# Altium project STM32_Smart.PrjPcb
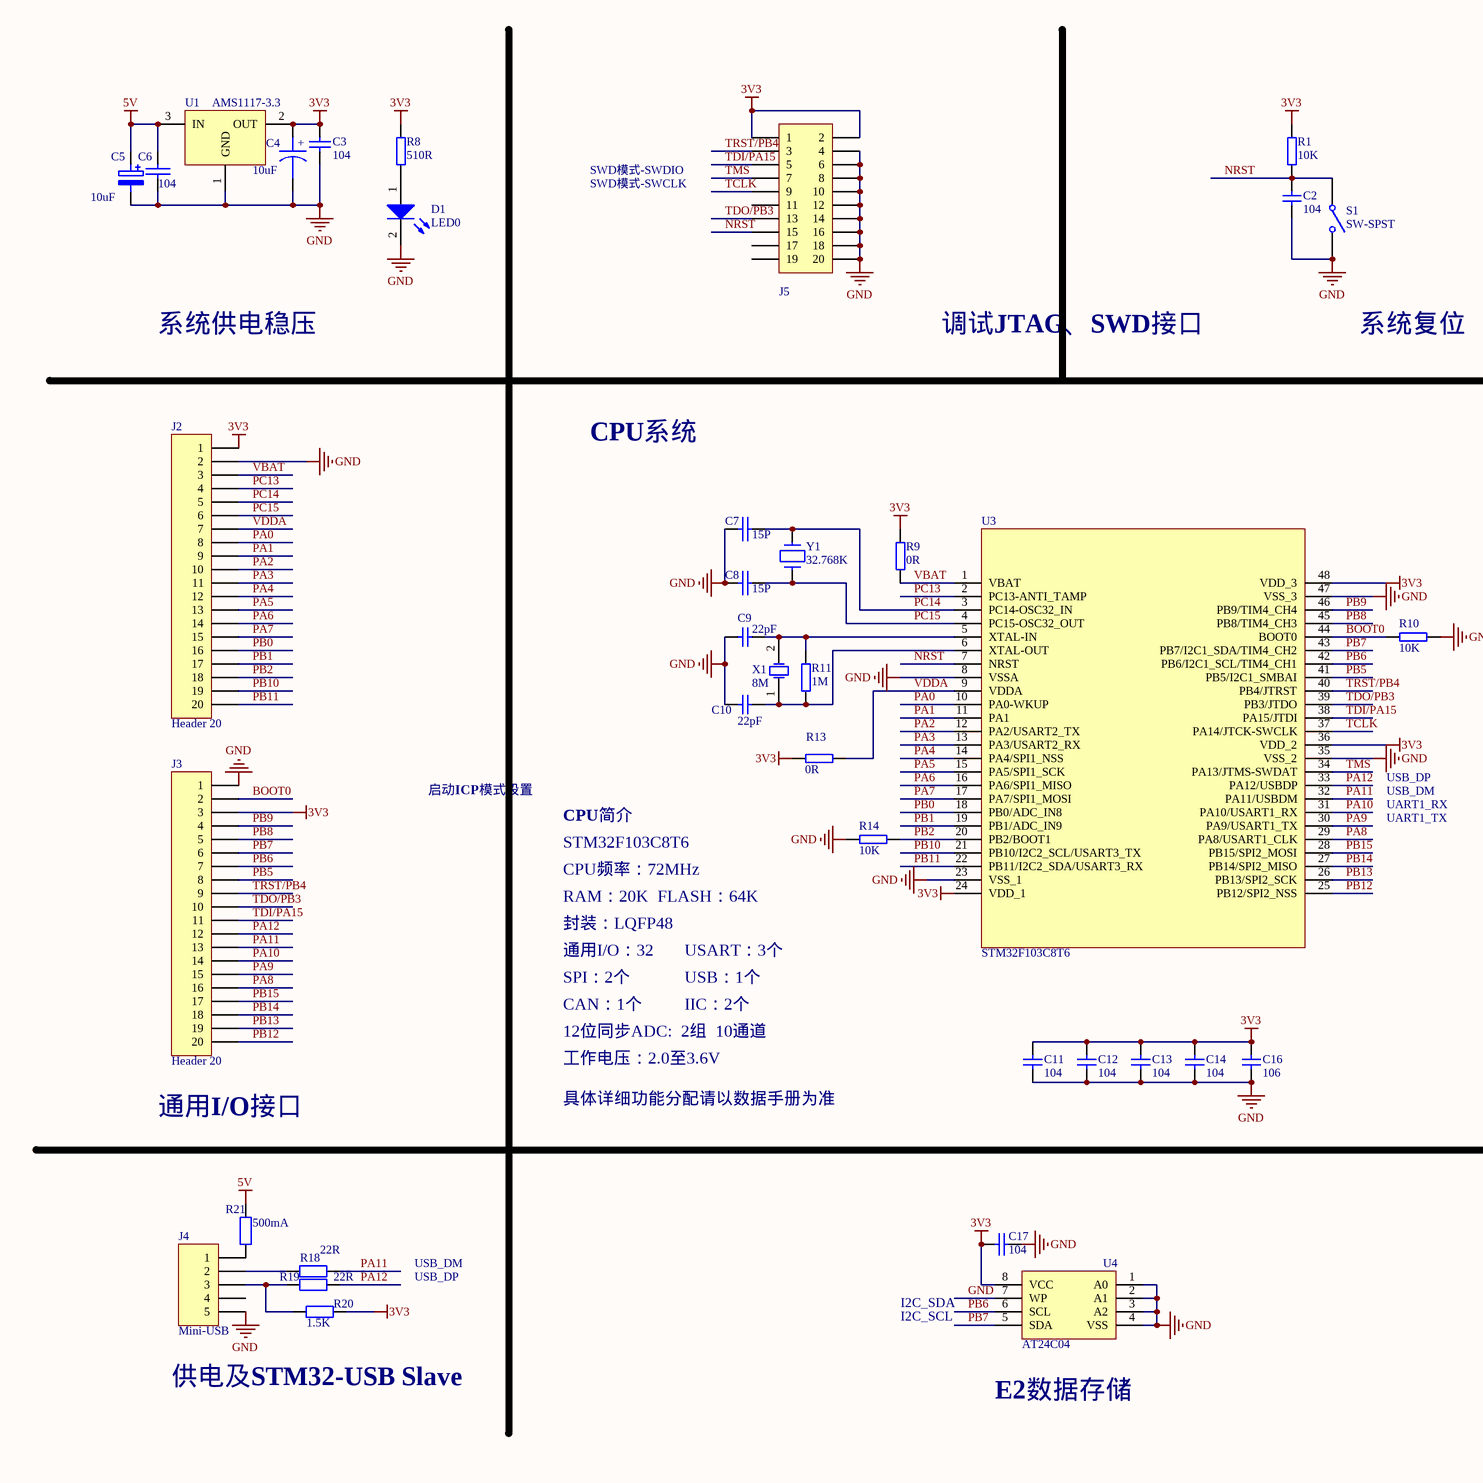
[diagram p0: STM32_Smart.SchDoc, left]
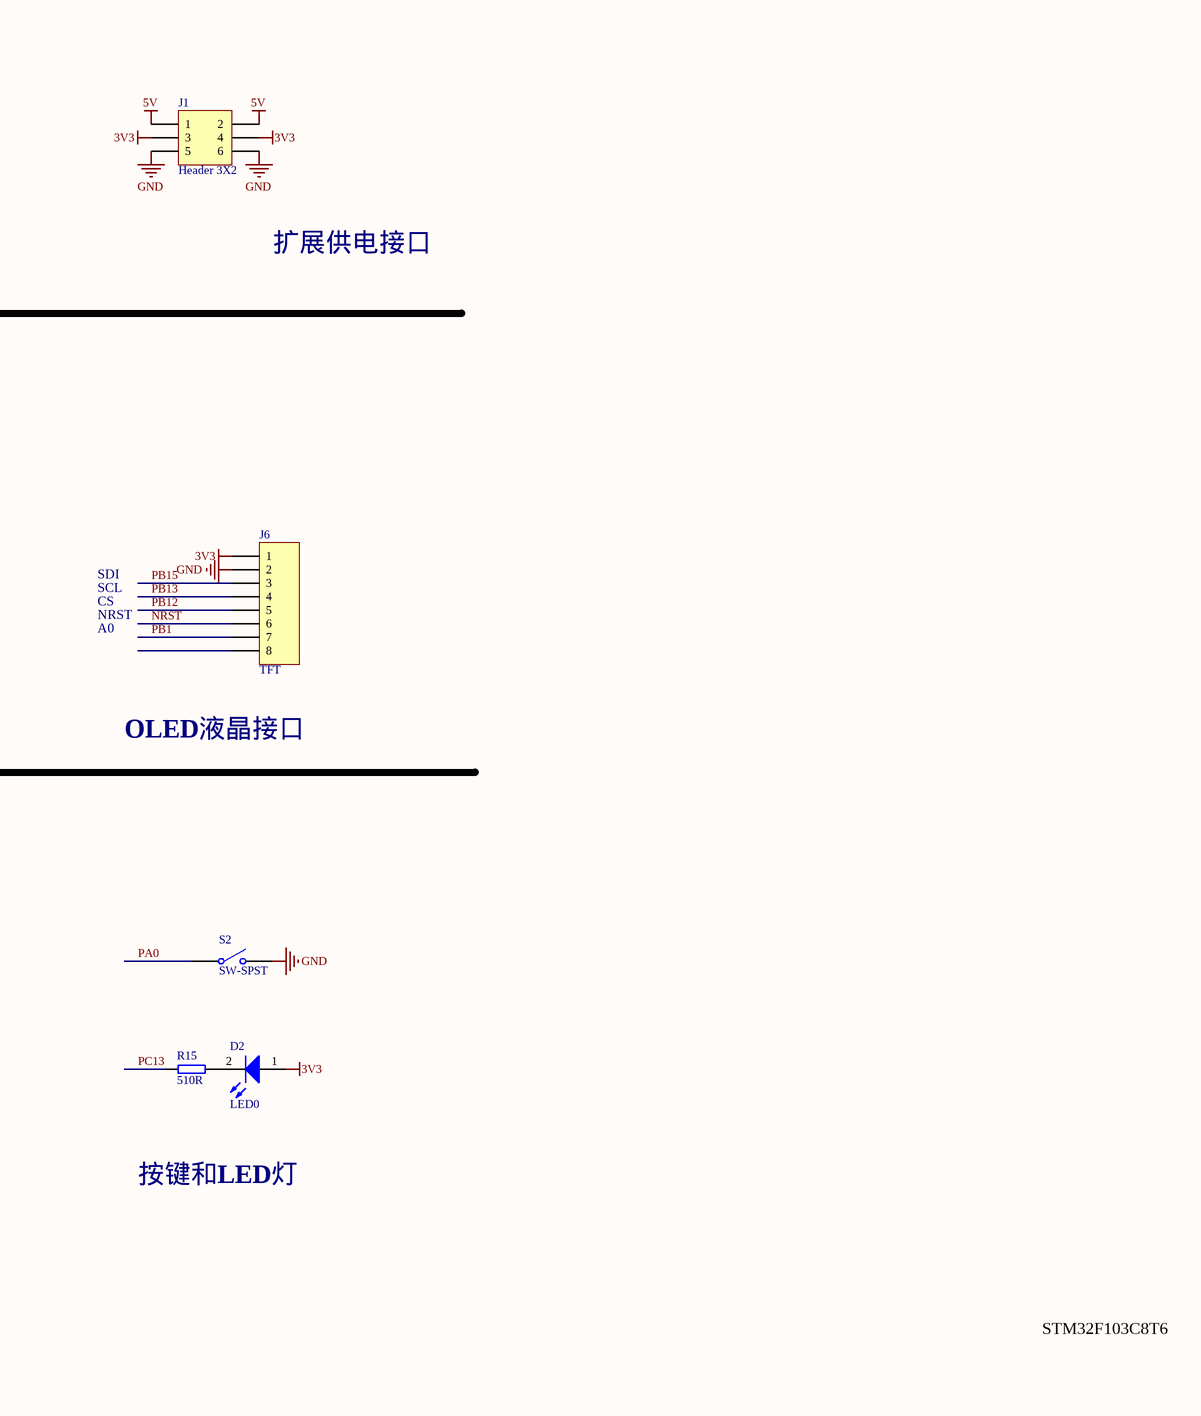
[diagram p1: STM32_Smart.SchDoc, right]
1 sheet, 42 parts. Net scope: global (net labels, ports and power ports of the same name join across sheets).
Board file: STM32_Smart.PcbDoc

## Sheet STM32_Smart.SchDoc
size A3

### Parts
C2  104  [RC0603]
C3  104  [RC0603]
C4  10uF  [RC0805]
C5  10uF  [RC0805]
C6  104  [RC0603]
C7  15P  [RC0603]
C8  15P  [RC0603]
C9  22pF  [RC0603]
C10  22pF  [RC0603]
C11  104  [RC0603]
C12  104  [RC0603]
C13  104  [RC0603]
C14  104  [RC0603]
C16  106  [RC0805]
C17  104  [RC0603]
D1  LED0  [LED0805]
D2  LED0  [LED0805]
J1  Header 3X2  [IDE3X2-2.54]
J2  Header 20  [HDR1X20]
J3  Header 20  [HDR1X20]
J4  Mini-USB  [mini_USB]
J5  (no value)  [JTAG20P]
J6  TFT  [HDR1X8]
R1  10K  [RC0603]
R8  510R  [RC0603]
R9  0R  [RC0603]
R10  10K  [RC0603]
R11  1M  [RC0603]
R13  0R  [RC0603]
R14  10K  [RC0603]
R15  510R  [RC0603]
R18  22R  [RC0603]
R19  22R  [RC0603]
R20  1.5K  [RC0603]
R21  500mA  [RC0805]
S1  SW-SPST  [SMT-KEY]
S2  SW-SPST  [SMT-KEY]
U1  AMS1117-3.3  [SOT223]
U3  STM32F103C8T6  [LQFP48]
U4  AT24C04  [SOIC-8P]
X1  8M  [SMD49S]
Y1  32.768K  [JZ32768]

### Nets
3V3: C3.1 C4.1 C11.1 C12.1 C13.1 C14.1 C16.1 C17.2 D2.1(A) J1.3 J1.4 J2.1 J3.3 J5.1 J5.2 J6.1 R1.2 R8.2 R9.2 R13.2 R20.1 U1.2(OUT) U3.24(VDD_1) U3.36(VDD_2) U3.48(VDD_3) U4.8(VCC)
5V: C5.1 C6.1 J1.1 J1.2 R21.1 U1.3(IN)
GND: C2.2 C3.2 C4.2 C5.2 C6.2 C7.1 C8.1 C9.2 C10.2 C11.2 C12.2 C13.2 C14.2 C16.2 C17.1 D1.2(K) J1.5 J1.6 J2.2 J3.1 J4.5 J5.4 J5.6 J5.8 J5.10 J5.12 J5.14 J5.16 J5.18 J5.20 J6.2 R10.1 R14.2 S1.2(NO) S2.2(NO) U1.1(GND) U3.8(VSSA) U3.23(VSS_1) U3.35(VSS_2) U3.47(VSS_3) U4.1(A0) U4.2(A1) U4.3(A2) U4.4(VSS) U4.7(WP)
BOOT0: J3.2 R10.2 U3.44(BOOT0)
NRST: C2.1 J5.15 J6.6 R1.1 S1.1(COMMON) U3.7(NRST)
PA0: J2.8 S2.1(COMMON) U3.10(PA0-WKUP)
PA1: J2.9 U3.11(PA1)
PA2: J2.10 U3.12(PA2/USART2_TX)
PA3: J2.11 U3.13(PA3/USART2_RX)
PA4: J2.12 U3.14(PA4/SPI1_NSS)
PA5: J2.13 U3.15(PA5/SPI1_SCK)
PA6: J2.14 U3.16(PA6/SPI1_MISO)
PA7: J2.15 U3.17(PA7/SPI1_MOSI)
PA8: J3.16 U3.29(PA8/USART1_CLK)
PA9: J3.15 U3.30(PA9/USART1_TX)
PA10: J3.14 U3.31(PA10/USART1_RX)
PA11: J3.13 R18.1 U3.32(PA11/USBDM)
PA12: J3.12 R19.1 U3.33(PA12/USBDP)
PB0: J2.16 U3.18(PB0/ADC_IN8)
PB1: J2.17 J6.7 U3.19(PB1/ADC_IN9)
PB2: J2.18 R14.1 U3.20(PB2/BOOT1)
PB5: J3.8 U3.41(PB5/I2C1_SMBAI)
PB6: J3.7 U3.42(PB6/I2C1_SCL/TIM4_CH1) U4.6(SCL)
PB7: J3.6 U3.43(PB7/I2C1_SDA/TIM4_CH2) U4.5(SDA)
PB8: J3.5 U3.45(PB8/TIM4_CH3)
PB9: J3.4 U3.46(PB9/TIM4_CH4)
PB10: J2.19 U3.21(PB10/I2C2_SCL/USART3_TX)
PB11: J2.20 U3.22(PB11/I2C2_SDA/USART3_RX)
PB12: J3.20 J6.5 U3.25(PB12/SPI2_NSS)
PB13: J3.19 J6.4 U3.26(PB13/SPI2_SCK)
PB14: J3.18 U3.27(PB14/SPI2_MISO)
PB15: J3.17 J6.3 U3.28(PB15/SPI2_MOSI)
PC13: J2.4 R15.1 U3.2(PC13-ANTI_TAMP)
PC14: C7.2 J2.5 U3.3(PC14-OSC32_IN) Y1.2
PC15: C8.2 J2.6 U3.4(PC15-OSC32_OUT) Y1.1
TCLK: J5.9 U3.37(PA14/JTCK-SWCLK)
TDI/PA15: J3.11 J5.5 U3.38(PA15/JTDI)
TDO/PB3: J3.10 J5.13 U3.39(PB3/JTDO)
TMS: J5.7 U3.34(PA13/JTMS-SWDAT)
TRST/PB4: J3.9 J5.3 U3.40(PB4/JTRST)
VBAT: J2.3 R9.1 U3.1(VBAT)
VDDA: J2.7 R13.1 U3.9(VDDA)
NetC9_1: C9.1 R11.2 U3.5(XTAL-IN) X1.2
NetC10_1: C10.1 R11.1 U3.6(XTAL-OUT) X1.1
NetD1_1: D1.1(A) R8.1
NetD2_2: D2.2(K) R15.2
NetJ4_1: J4.1 R21.2
NetJ4_2: J4.2 R18.2
NetJ4_3: J4.3 R19.2 R20.2

Not connected (* = marked no-connect by the designer): J4 4; J5 11 17 19; J6 8

### Notes on the sheet
- SWD模式-SWCLK
- SWD模式-SWDIO
- 系统供电稳压
- (near J5) 调试JTAG、SWD接口
- 系统复位
- 扩展供电接口
- CPU系统
- SDI
- SCL
- CS
- NRST
- A0
- 启动ICP模式设置
- CPU简介
- UART1_TX
- UART1_RX
- USB_DM
- USB_DP
- OLED液晶接口
- STM32F103C8T6
- RAM：20K
- CPU频率：72MHz
- FLASH：64K
- 封装：LQFP48
- 通用I/O：32
- USART：3个
- CAN：1个
- 12位同步ADC:  2组  10通道
- SPI：2个
- USB：1个
- IIC：2个
- 工作电压：2.0至3.6V
- 具体详细功能分配请以数据手册为准
- (near J3) 通用I/O接口
- I2C_SDA
- 按键和LED灯
- I2C_SCL
- 供电及STM32-USB Slave
- (near U4) E2数据存储
- (in symbol CAPACITOR POL) +

### Library data of the parts
C2 C11-C14 C16 = CAP1: Capacitor; Tolerate: 50V; Value: 100nF; TOL: 10%; ERP: 0103020075; PCB_Layout: Top Layer SMC; Revision: 2012-3-28; Publisher: ZL_A0OFFICE
C3 C17 = Cap: Capacitor
  C3: Published: 8-Jun-2000; LatestRevisionDate: 17-Jul-2002; LatestRevisionNote: Re-released for DXP Platform.; PackageReference: RAD-0.3; Publisher: Altium Limited
C4 = CAPACITOR POL: Capacitor
C5 = ELECTRO2
C6 = CAP: Capacitor
C7 C8 = CAP
C9 C10 = CAP1: Capacitor; Tolerate: 50V; Value: 20pF; TOL: 2%; ERP: 0103020090; PCB_Layout: Top Layer SMC; Revision: 2012-3-28; Publisher: ZL_A0OFFICE
D1 D2 = LED0: Typical INFRARED GaAs LED
J1 = Header 3X2: Header, 3-Pin, Dual row; LatestRevisionDate: 17-Jul-2002; LatestRevisionNote: Re-released for DXP Platform.; Publisher: Altium Limited
J2 J3 = Header 20: Header, 20-Pin; LatestRevisionDate: 17-Jul-2002; LatestRevisionNote: Re-released for DXP Platform.; Publisher: Altium Limited
J4 = Header 5: Header, 5-Pin
J5 = Header 10X2H: Header, 10-Pin, Dual row, Right Angle; LatestRevisionDate: 17-Jul-2002; LatestRevisionNote: Re-released for DXP Platform.; Publisher: Altium Limited
J6 = Header 8: Header, 8-Pin
R1 R8-R11 R13-R15 = R
R18-R21 = Res2: Resistor
S1 S2 = SW-SPST: Single-Pole, Single-Throw Switch
U1 = LT1085CM-3.3
U4 = EPROM
X1 = XTAL_SMD: Crystal Oscillator; ERP: 0103040021; Value: 8MHz; TOL: ±20ppm; Tolerate: ROSON -20_+70 20pf; PCB_Layout: Top Layer SMC; Publisher: ZL_A0OFFICE; Revision: 2012-3-28
Y1 = CRYSTAL: 晶振